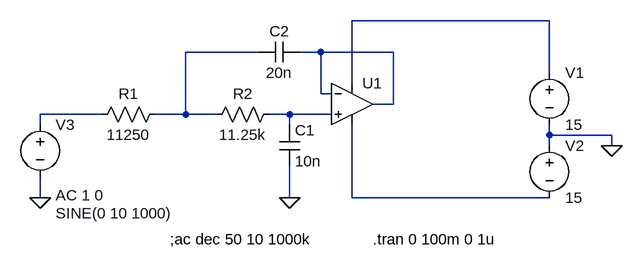
[diagram p0: schematic Filtro PassaBaixas_02.asc]
Filtro PassaBaixas_02.asc, the LTspice schematic file:
Version 4
SHEET 1 880 680
WIRE 544 48 240 48
WIRE 96 96 -16 96
WIRE 192 96 160 96
WIRE 304 96 192 96
WIRE 544 128 544 48
WIRE 240 144 240 48
WIRE 192 160 192 96
WIRE 208 160 192 160
WIRE 304 176 304 96
WIRE 304 176 272 176
WIRE -144 192 -240 192
WIRE -16 192 -16 96
WIRE -16 192 -64 192
WIRE 32 192 -16 192
WIRE 144 192 112 192
WIRE 208 192 144 192
WIRE -240 208 -240 192
WIRE 144 208 144 192
WIRE 544 224 544 208
WIRE 640 224 544 224
WIRE 544 240 544 224
WIRE 640 240 640 224
WIRE -240 320 -240 288
WIRE 144 320 144 272
WIRE 240 320 240 208
WIRE 544 320 240 320
FLAG 144 320 0
FLAG -240 320 0
FLAG 640 240 0
SYMBOL OpAmps\\UniversalOpAmp 240 176 R0
SYMATTR InstName U1
SYMBOL cap 128 208 R0
SYMATTR InstName C1
SYMATTR Value 10n
SYMBOL cap 160 80 R90
WINDOW 0 0 32 VBottom 2
WINDOW 3 32 32 VTop 2
SYMATTR InstName C2
SYMATTR Value 20n
SYMBOL res -48 176 R90
WINDOW 0 0 56 VBottom 2
WINDOW 3 32 56 VTop 2
SYMATTR InstName R1
SYMATTR Value 11250
SYMBOL res 128 176 R90
WINDOW 0 0 56 VBottom 2
WINDOW 3 32 56 VTop 2
SYMATTR InstName R2
SYMATTR Value 11.25k
SYMBOL voltage 544 112 R0
WINDOW 123 0 0 Left 0
WINDOW 39 0 0 Left 0
SYMATTR InstName V1
SYMATTR Value 15
SYMBOL voltage 544 224 R0
WINDOW 123 0 0 Left 0
WINDOW 39 0 0 Left 0
SYMATTR InstName V2
SYMATTR Value 15
SYMBOL voltage -240 192 R0
WINDOW 3 24 152 Left 2
WINDOW 123 24 124 Left 2
WINDOW 39 0 0 Left 0
SYMATTR InstName V3
SYMATTR Value SINE(0 10 1000)
SYMATTR Value2 AC 1 0
TEXT -40 384 Left 2 !;ac dec 50 10 1000k
TEXT 272 384 Left 2 !.tran 0 100m 0 1u

The netlist it stands for:
* Filtro PassaBaixas_02.asc
XU1 N005 N003 N001 N006 N003 level1 Avol=1Meg GBW=10Meg Vos=0 En=0 Enk=0 In=0 Ink=0 Rin=500Meg  ; pins In+ In- V+ V- OUT
C1 N005 0 10n
C2 N003 N002 20n
R1 N002 N004 11250
R2 N005 N002 11.25k
V1 N001 0 15
V2 0 N006 15
V3 N004 0 SINE(0 10 1000) AC 1 0
;ac dec 50 10 1000k
.tran 0 100m 0 1u
.lib UniversalOpAmp1.lib
.backanno
.end